# EAGLE schematic FirstStandaloneMega (EAGLE 8.7.1)
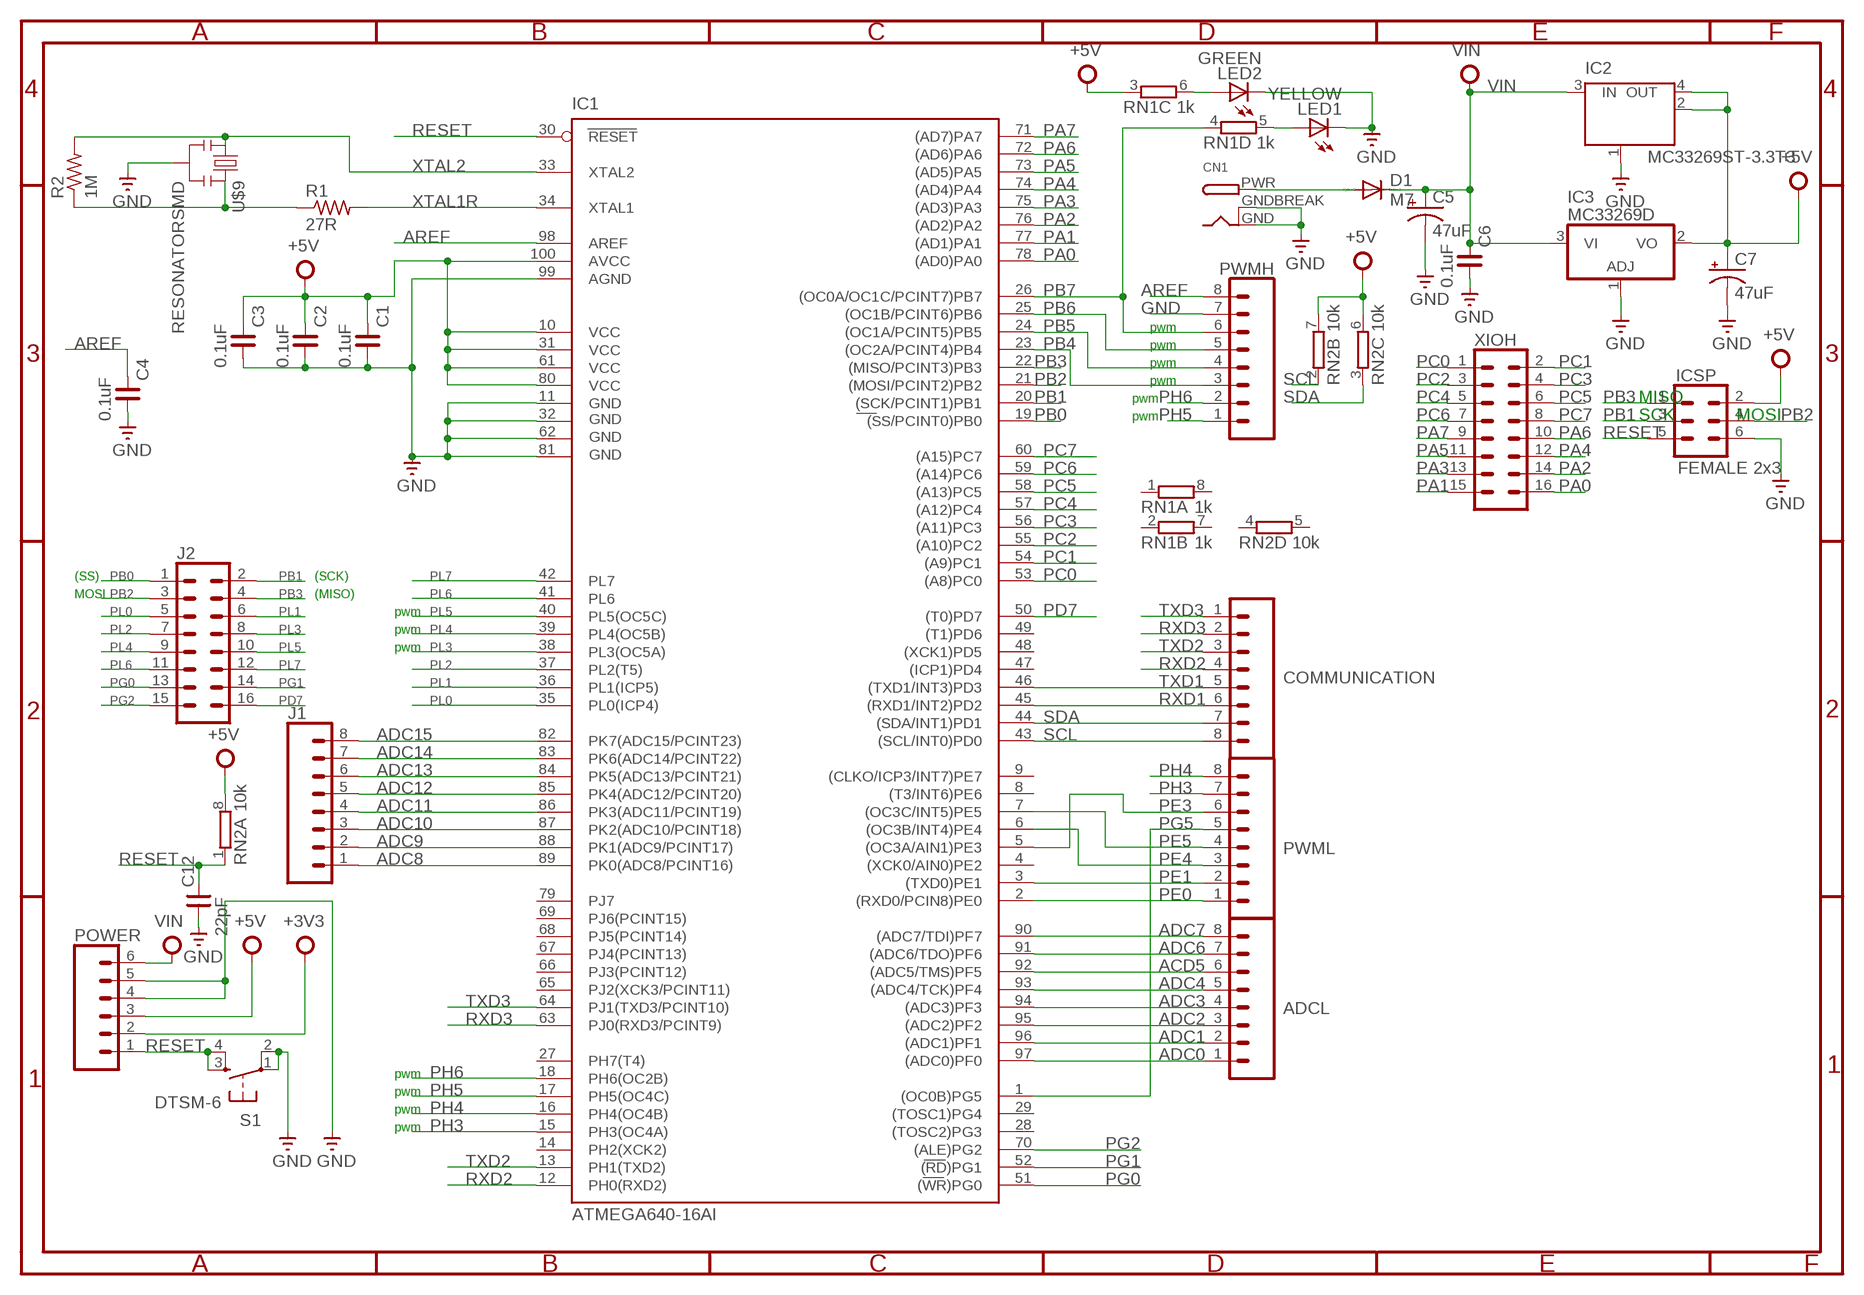
[diagram p0: schematic, sheet 1]

## Parts
ADCL  CONN_08"  [1X08]
C1  0.1uF  C_0805  [C0805]
C2  0.1uF  C_0805  [C0805]
C3  0.1uF  C_0805  [C0805]
C4  0.1uF  C_0805  [C0805]
C5  47uF  CPOL-USD  [PANASONIC_D]
C6  0.1uF  C_0805  [C0805]
C7  47uF  CPOL-USD  [PANASONIC_D]
C12  22pF  CNP-0805  [0805]
CN1  DCBARRELPTH  [DCJACK_2MM_PTH]
COMMUNICATION  CONN_08"  [1X08]
D1  M7  DIODE-SMB  [SMB]
IC1  ATMEGA640-16AI  [TQFP100]
IC2  MC33269ST-3.3T3  [SOT223]
IC3  MC33269D  [DPACK]
ICSP  FEMALE 2x3  CONN_03X2FEMALE  [2X3]
J1  CONN_08"  [1X08]
J2  CONN_08X2  [2X8]
LED1  YELLOW  LEDCHIPLED_0805  [CHIPLED_0805]
LED2  GREEN  LEDCHIPLED_0805  [CHIPLED_0805]
POWER  CONN_06SILK_FEMALE_PTH  [1X06]
PWMH  CONN_08"  [1X08]
PWML  CONN_08"  [1X08]
R1  27R  R-US_R0805  [R0805]
R2  1M  R-US_R0805  [R0805]
RN1  1k  4R-NCAY16  [CAY16]
RN2  10k  4R-NCAY16  [CAY16]
S1  DTSM-6  [DTSM-6]
U$9  RESONATORSMD  [RESONATOR-SMD]
XIOH  CONN_08X2  [2X8]

## Nets
+3V3: POWER.2
+5V: C1.2 C2.2 C3.2 C7.+ IC1.10(VCC) IC1.31(VCC1) IC1.61(VCC2) IC1.80(VCC3) IC1.100(AVCC) IC2.2(OUT) IC2.4(OUT) IC3.2(VO) ICSP.2 POWER.3 RN1.3 RN2.6 RN2.7 RN2.8
ACD5: ADCL.6 IC1.92((ADC5/TMS)PF5)
ADC0: ADCL.1 IC1.97((ADC0)PF0)
ADC1: ADCL.2 IC1.96((ADC1)PF1)
ADC2: ADCL.3 IC1.95((ADC2)PF2)
ADC3: ADCL.4 IC1.94((ADC3)PF3)
ADC4: ADCL.5 IC1.93((ADC4/TCK)PF4)
ADC6: ADCL.7 IC1.91((ADC6/TDO)PF6)
ADC7: ADCL.8 IC1.90((ADC7/TDI)PF7)
ADC8: IC1.89(PK0(ADC8/PCINT16)) J1.1
ADC9: IC1.88(PK1(ADC9/PCINT17)) J1.2
ADC10: IC1.87(PK2(ADC10/PCINT18)) J1.3
ADC11: IC1.86(PK3(ADC11/PCINT19)) J1.4
ADC12: IC1.85(PK4(ADC12/PCINT20)) J1.5
ADC13: IC1.84(PK5(ADC13/PCINT21)) J1.6
ADC14: IC1.83(PK6(ADC14/PCINT22)) J1.7
ADC15: IC1.82(PK7(ADC15/PCINT23)) J1.8
AREF: C4.2 IC1.98(AREF) PWMH.8
GND: C1.1 C2.1 C3.1 C4.1 C5.- C6.1 C7.- C12.1 CN1.GND CN1.GNDBREAK IC1.11(GND) IC1.32(GND1) IC1.62(GND2) IC1.81(GND3) IC1.99(AGND) IC2.1(GND/ADJ) IC3.1(ADJ) ICSP.6 LED1.C LED2.C POWER.4 POWER.5 PWMH.7 S1.1 S1.2 U$9.2
N$2: R1.1 R2.1 U$9.3
N$3: LED1.A RN1.5
N$4: CN1.PWR D1.A
N$6: LED2.A RN1.6
PA0: IC1.78((AD0)PA0) XIOH.16
PA1: IC1.77((AD1)PA1) XIOH.15
PA2: IC1.76((AD2)PA2) XIOH.14
PA3: IC1.75((AD3)PA3) XIOH.13
PA4: IC1.74((AD4)PA4) XIOH.12
PA5: IC1.73((AD5)PA5) XIOH.11
PA6: IC1.72((AD6)PA6) XIOH.10
PA7: IC1.71((AD7)PA7) XIOH.9
PB0: IC1.19((SS/PCINT0)PB0) J2.1
PB1: IC1.20((SCK/PCINT1)PB1) ICSP.3 J2.2
PB2: IC1.21((MOSI/PCINT2)PB2) ICSP.4 J2.3
PB3: IC1.22((MISO/PCINT3)PB3) ICSP.1 J2.4
PB4: IC1.23((OC2A/PCINT4)PB4) PWMH.3
PB5: IC1.24((OC1A/PCINT5)PB5) PWMH.4
PB6: IC1.25((OC1B/PCINT6)PB6) PWMH.5
PB7: IC1.26((OC0A/OC1C/PCINT7)PB7) PWMH.6 RN1.4
PC0: IC1.53((A8)PC0) XIOH.1
PC1: IC1.54((A9)PC1) XIOH.2
PC2: IC1.55((A10)PC2) XIOH.3
PC3: IC1.56((A11)PC3) XIOH.4
PC4: IC1.57((A12)PC4) XIOH.5
PC5: IC1.58((A13)PC5) XIOH.6
PC6: IC1.59((A14)PC6) XIOH.7
PC7: IC1.60((A15)PC7) XIOH.8
PD7: IC1.50((T0)PD7) J2.16
PE0: IC1.2((RXD0/PCIN8)PE0) PWML.1
PE1: IC1.3((TXD0)PE1) PWML.2
PE3: IC1.5((OC3A/AIN1)PE3) PWML.6
PE4: IC1.6((OC3B/INT4)PE4) PWML.3
PE5: IC1.7((OC3C/INT5)PE5) PWML.4
PG0: IC1.51((WR)PG0) J2.13
PG1: IC1.52((RD)PG1) J2.14
PG2: IC1.70((ALE)PG2) J2.15
PG5: IC1.1((OC0B)PG5) PWML.5
PH3: IC1.15(PH3(OC4A)) PWML.7
PH4: IC1.16(PH4(OC4B)) PWML.8
PH5: IC1.17(PH5(OC4C)) PWMH.1
PH6: IC1.18(PH6(OC2B)) PWMH.2
PL0: IC1.35(PL0(ICP4)) J2.5
PL1: IC1.36(PL1(ICP5)) J2.6
PL2: IC1.37(PL2(T5)) J2.7
PL3: IC1.38(PL3(OC5A)) J2.8
PL4: IC1.39(PL4(OC5B)) J2.9
PL5: IC1.40(PL5(OC5C)) J2.10
PL6: IC1.41(PL6) J2.11
PL7: IC1.42(PL7) J2.12
RESET: C12.2 IC1.30(RESET) ICSP.5 POWER.1 RN2.1 S1.3 S1.4
RXD1: COMMUNICATION.6 IC1.45((RXD1/INT2)PD2)
RXD2: COMMUNICATION.4 IC1.12(PH0(RXD2))
RXD3: COMMUNICATION.2 IC1.63(PJ0(RXD3/PCINT9))
SCL: COMMUNICATION.8 IC1.43((SCL/INT0)PD0) RN2.2
SDA: COMMUNICATION.7 IC1.44((SDA/INT1)PD1) RN2.3
TXD1: COMMUNICATION.5 IC1.46((TXD1/INT3)PD3)
TXD2: COMMUNICATION.3 IC1.13(PH1(TXD2))
TXD3: COMMUNICATION.1 IC1.64(PJ1(TXD3/PCINT10))
VIN: C5.+ C6.2 D1.C IC2.3(IN) IC3.3(VI) POWER.6
XTAL1R: IC1.34(XTAL1) R1.2
XTAL2: IC1.33(XTAL2) R2.2 U$9.1
Unconnected: IC1.4((XCK0/AIN0)PE2) IC1.8((T3/INT6)PE6) IC1.9((CLKO/ICP3/INT7)PE7) IC1.14(PH2(XCK2)) IC1.27(PH7(T4)) IC1.28((TOSC2)PG3) IC1.29((TOSC1)PG4) IC1.47((ICP1)PD4) IC1.48((XCK1)PD5) IC1.49((T1)PD6) IC1.65(PJ2(XCK3/PCINT11)) IC1.66(PJ3(PCINT12)) IC1.67(PJ4(PCINT13)) IC1.68(PJ5(PCINT14)) IC1.69(PJ6(PCINT15)) IC1.79(PJ7) RN1.1 RN1.2 RN1.7 RN1.8 RN2.4 RN2.5

## Notes on the sheet
- pwm
- pwm
- pwm
- pwm
- pwm | MISO
- pwm | SCK | MOSI
- (SS) | (SCK)
- MOSI | (MISO)
- pwm
- pwm
- pwm
- pwm
- pwm
- pwm
- pwm

## Library data of the parts
ADCL COMMUNICATION J1 PWMH PWML = SparkFun-Connectors:CONN_08: Multi connection point. Often used as Generic Header-pin footprint for 0.1 inch spaced/style header connections On any of the 0.1 inch spaced packages, you can populate with these: Break Away Headers - Straight <https://www.sparkfun.com/products/116> (PRT-00116) Break Away Male Headers - Right Angle <https://www.sparkfun.com/products/553> (PRT-00553) Female Headers <https://www.sparkfun.com/products/115> (PRT-00115) Break Away Headers - Machine Pin <https://www.sparkfun.com/products/117> (PRT-00117) Break Away Female Headers - Swiss Machine Pin <https://www.sparkfun.com/products/743> (PRT-00743) Arduino Stackable Header - 8 Pin <https://www.sparkfun.com/products/9279> (PRT-09279) For SCREWTERMINALS and SPRING TERMINALS visit here: Screw Terimnals on SparkFun.com <https://www.sparkfun.com/search/results?term=Screw+Terminals> (5mm/3.5mm/2.54mm spacing) This device is also useful as a general connection point to wire up your design to another part of your project. Our various solder wires solder well into these plated through hole pads. Hook-Up Wire - Assortment (Stranded, 22 AWG) <https://www.sparkfun.com/products/11375> (PRT-11375) Hook-Up Wire - Assortment (Solid Core, 22 AWG) <https://www.sparkfun.com/products/11367> (PRT-11367) View the entire wire category on our website here <https://www.sparkfun.com/categories/141> Special notes: Molex polarized connector foot print use with SKU : PRT-08231 with associated crimp pins and housings. 1MM SMD Version SKU: PRT-10208 NOTES ON THE VARIANTS LOCK and LOCK_LONGPADS... This footprint was designed to help hold the alignment of a through-hole component (i.e. 6-pin header) while soldering it into place. You may notice that each hole has been shifted either up or down by 0.005 of an inch from it's more standard position (which is a perfectly straight line). This slight alteration caused the pins (the squares in the middle) to touch the edges of the holes. Because they are alternating, it causes a "brace" to hold the component in place. 0.005 has proven to be the perfect amount of "off-center" position when using our standard breakaway headers. Although looks a little odd when you look at the bare footprint, once you have a header in there, the alteration is very hard to notice. Also,if you push a header all the way into place, it is covered up entirely on the bottom side.; PROD_ID: CONN-08438
C1-C4 C6 = rc-master:C_: NON-POLARIZED CAP
C5 C7 = rcl:CPOL-US: POLARIZED CAPACITOR, American symbol; SPICEPREFIX: C
C12 = cap-master:CNP-: NON-POLARIZED CAP
CN1 = microbuilder:DCBARREL: DC Barrel Jack DCJACK_1.3MM_PTH - Through Hole 1.3mm Jack (4UConnector: 05536) DCJACK_2MM_PTH - Through Hole 2.0/2.1 Jack (4UConnector: 05537) DCJACK_2MM_SMT - SMT 2.0/2.1mm Jack(4UConnector: 03267)
D1 = diode:DIODE-: DIODE
IC1 = atmel-2005:ATMEGA*: MICROCONTROLLER 64/128/256 Kbytes FLASH 4 Kbytes EEPROM 8 Kbytes SRAM 86 General Purpose I/O pins 12-channels16-bit PWM 4 x Serial USARTs 16-channels 10-bit A/D
IC2 = linear:MC33269ST*: Adjustable Output Low Dropout Voltage Regulator 800 mA Source: http://www.onsemi.com/pub/Collateral/MC33269-D.PDF
IC3 = linear:MC33269?*: Adjustable Output Low Dropout Voltage Regulator 800 mA Source: http://www.onsemi.com/pub/Collateral/MC33269-D.PDF
ICSP = SparkFun-Connectors:CONN_03X2: Multi connection point. Often used as Generic Header-pin footprint for 0.1 inch spaced/style header connections You can populate with any combo of single row headers, but if you'd like an exact match, check these: Header - 2x3 (Male, 0.1") <https://www.sparkfun.com/products/12807> (PRT-12807) Header - 2x3 (Female, 0.1") <https://www.sparkfun.com/products/13010> (PRT-13010) 2x3 Pin Shrouded Header <https://www.sparkfun.com/products/10877> (PRT-10877) On any of the 0.1 inch spaced packages, you can populate with these: Break Away Headers - Straight <https://www.sparkfun.com/products/116> (PRT-00116) Break Away Male Headers - Right Angle <https://www.sparkfun.com/products/553> (PRT-00553) Female Headers <https://www.sparkfun.com/products/115> (PRT-00115) Break Away Headers - Machine Pin <https://www.sparkfun.com/products/117> (PRT-00117) Break Away Female Headers - Swiss Machine Pin <https://www.sparkfun.com/products/743> (PRT-00743) Special note: the shrouded connector mates well with our 3x2 ribbon cables: Ribbon Crimp Connector - 6-pin (2x3, Female) <https://www.sparkfun.com/products/10651> (PRT-10651) Ribbon Cable - 6 wire (15ft) <https://www.sparkfun.com/products/10646> (PRT-10646); PROD_ID: CONN-11566
J2 XIOH = SparkFun-Connectors:CONN_08X2: Multi connection point. Often used as Generic Header-pin footprint for 0.1 inch spaced/style header connections You can populate with any combo of single row headers, but if you'd like an exact match, check this: Header - 2x8 (Male, 0.1") <https://www.sparkfun.com/products/13156> (PRT-13156) On any of the 0.1 inch spaced packages, you can populate with these: Break Away Headers - Straight <https://www.sparkfun.com/products/116> (PRT-00116) Break Away Male Headers - Right Angle <https://www.sparkfun.com/products/553> (PRT-00553) Female Headers <https://www.sparkfun.com/products/115> (PRT-00115) Break Away Headers - Machine Pin <https://www.sparkfun.com/products/117> (PRT-00117) Break Away Female Headers - Swiss Machine Pin <https://www.sparkfun.com/products/743> (PRT-00743)
LED1 LED2 = adafruit:LED: LED OSRAM: - CHIPLED LG R971, LG N971, LY N971, LG Q971, LY Q971, LO R971, LY R971 LH N974, LH R974 LS Q976, LO Q976, LY Q976 LO Q996 - Hyper CHIPLED LW Q18S LB Q993, LB Q99A, LB R99A - SideLED LS A670, LO A670, LY A670, LG A670, LP A670 LB A673, LV A673, LT A673, LW A673 LH A674 LY A675 LS A676, LA A676, LO A676, LY A676, LW A676 LS A679, LY A679, LG A679 - Hyper Micro SIDELED® LS Y876, LA Y876, LO Y876, LY Y876 LT Y87S - SmartLED LW L88C, LW L88S LB L89C, LB L89S, LG L890 LS L89K, LO L89K, LY L89K LS L896, LA L896, LO L896, LY L896 - TOPLED LS T670, LO T670, LY T670, LG T670, LP T670 LSG T670, LSP T670, LSY T670, LOP T670, LYG T670 LG T671, LOG T671, LSG T671 LB T673, LV T673, LT T673, LW T673 LH T674 LS T676, LA T676, LO T676, LY T676, LB T676, LH T676, LSB T676, LW T676 LB T67C, LV T67C, LT T67C, LS T67K, LO T67K, LY T67K, LW E67C LS E67B, LA E67B, LO E67B, LY E67B, LB E67C, LV E67C, LT E67C LW T67C LS T679, LY T679, LG T679 LS T770, LO T770, LY T770, LG T770, LP T770 LB T773, LV T773, LT T773, LW T773 LH T774 LS E675, LA E675, LY E675, LS T675 LS T776, LA T776, LO T776, LY T776, LB T776 LHGB T686 LT T68C, LB T68C - Hyper Mini TOPLED® LB M676 - Mini TOPLED Santana® LG M470 LS M47K, LO M47K, LY M47K Source: http://www.osram.convergy.de/
POWER = SparkFun-Connectors:CONN_06: Multi connection point. Often used as Generic Header-pin footprint for 0.1 inch spaced/style header connections On any of the 0.1 inch spaced packages, you can populate with these: Break Away Headers - Straight <https://www.sparkfun.com/products/116> (PRT-00116) Break Away Male Headers - Right Angle <https://www.sparkfun.com/products/553> (PRT-00553) Female Headers <https://www.sparkfun.com/products/115> (PRT-00115) Break Away Headers - Machine Pin <https://www.sparkfun.com/products/117> (PRT-00117) Break Away Female Headers - Swiss Machine Pin <https://www.sparkfun.com/products/743> (PRT-00743) Arduino Stackable Header - 6 Pin <https://www.sparkfun.com/products/9280> (PRT-09280) For SCREWTERMINALS and SPRING TERMINALS visit here: Screw Terimnals on SparkFun.com <https://www.sparkfun.com/search/results?term=Screw+Terminals> (5mm/3.5mm/2.54mm spacing) This device is also useful as a general connection point to wire up your design to another part of your project. Our various solder wires solder well into these plated through hole pads. Hook-Up Wire - Assortment (Stranded, 22 AWG) <https://www.sparkfun.com/products/11375> (PRT-11375) Hook-Up Wire - Assortment (Solid Core, 22 AWG) <https://www.sparkfun.com/products/11367> (PRT-11367) View the entire wire category on our website here <https://www.sparkfun.com/categories/141>; PROD_ID: CONN-08437
R1 R2 = adafruit:R-US_: RESISTOR, American symbol
RN1 RN2 = resistor-dil:4R-N: Array Chip Resistor Source: RS Component / Phycomp; OC_FARNELL: unknown; OC_NEWARK: unknown
S1 = switch-tact:DTSM-6
U$9 = SparkFun:RESONATOR: Resonator Small SMD resonator. This is the itty bitty 10/20MHz resonators with built in caps. CSTCE10M0G55 and CSTCE20M0V53. Footprint has been reviewed closely but hasn't been tested yet.

## Net classes
0 default: width 0.15 mm, drill 0.3 mm, clearance 0.15 mm